# Altium schematic sheet S1 - POWER.SchDoc: 3.3V LDO  AND ESD/EMI PROTECTION
size A; PROJECT_NAME: BLUETOOTH STATUS BOARD; SHEET_TITLE: POWER MANAGEMENT SUBSYSTEMS; SIZE: A; DOCUMENT_ID: MIL-2021-ELEC-BTSTAT; CHECKED_BY: A. KUZMICKI; Parameter 1: 0; FIELD_1: BT BOARD POWER SUBSYSTEM; FIELD_2: A; FIELD_3: BLUETOOTH STATUS BOARD; FIELD_4: 0; FIELD_5: MACHINE INTELLIGENCE LAB; FIELD_6: M. TALEBI; FIELD_7: MIL-ELECTRICAL; FIELD_8: A. KUZMICKI; Engineer: M. TALEBI; Organization: MACHINE INTELLIGENCE LAB; Revision: 0; Project: BLUETOOTH SYSTEM STATUS BOARD
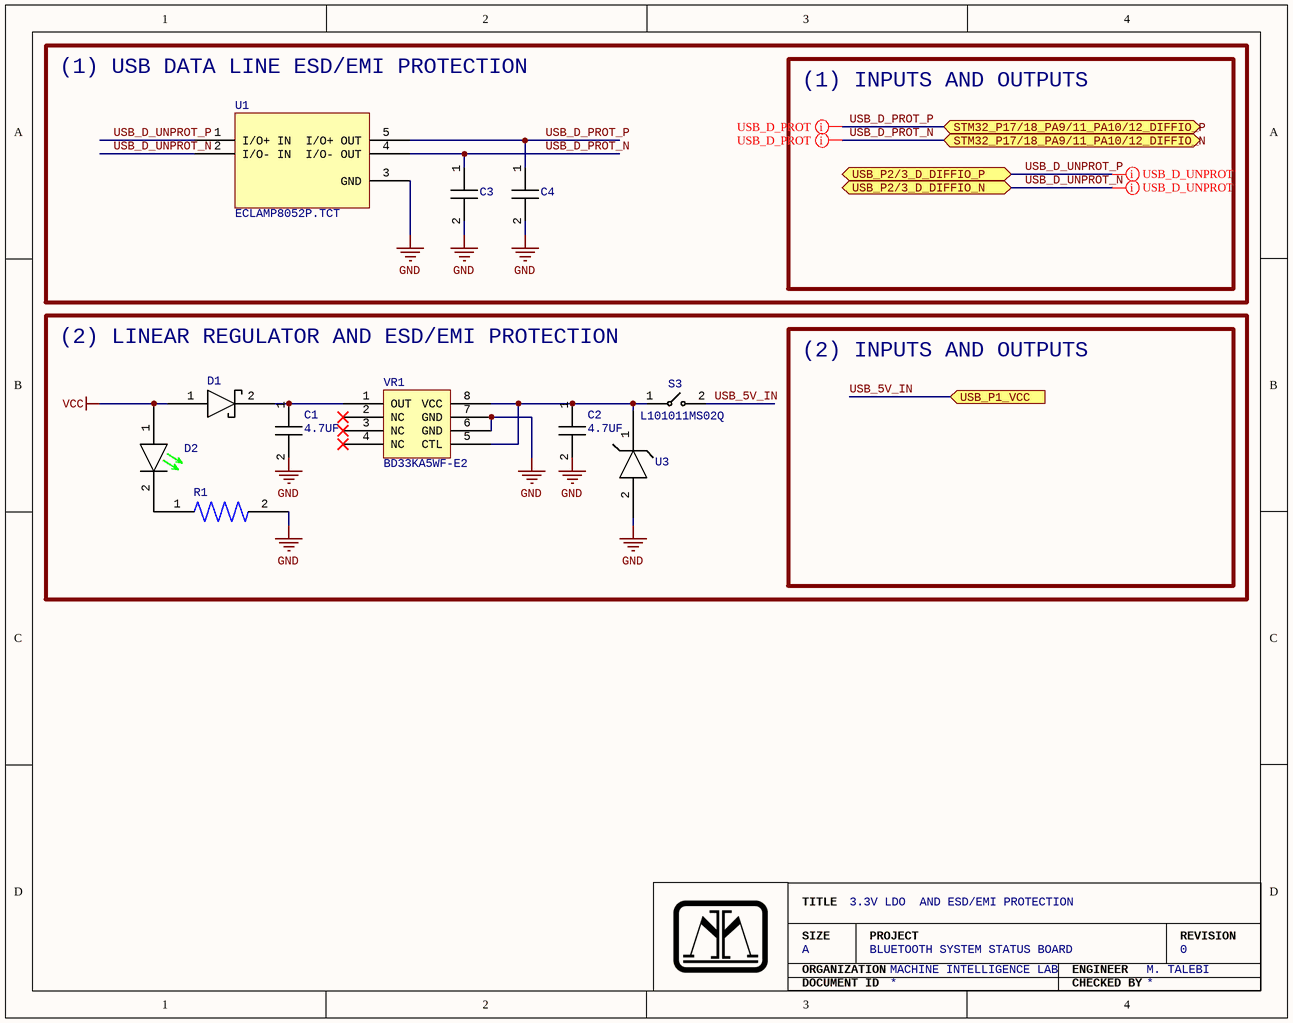
[diagram p0: S1 - POWER.SchDoc]

## Parts
C1  4.7UF  [TMK212AB7475KG-T]
C2  4.7UF  [TMK212AB7475KG-T]
C3  CC0603JRNPO8BN470  [CC0603JRNPO8BN470]  (value not drawn)
C4  CC0603JRNPO8BN470  [CC0603JRNPO8BN470]  (value not drawn)
D1  NRVB120VLSFT1G  [SODFL360X98-2N]  (value not drawn)
D2  151031VS06000  [151031VS06000]  (value not drawn)
R1  Y162440R0000B9R  [Y162440R0000B9R]  (value not drawn)
S3  L101011MS02Q  [L101011MS02Q]
U1  ECLAMP8052P.TCT  [ECLAMP8052P.TCT]
U3  UCLAMP0571P.TNT  [UCLAMP0571P.TNT]  (value not drawn)
VR1  BD33KA5WF-E2  [BD33KA5WF-E2]

## Ports
STM32_P17/18_PA9/11_PA10/12_DIFFIO_N (bidir), STM32_P17/18_PA9/11_PA10/12_DIFFIO_P (bidir), USB_P1_VCC (in), USB_P2/3_D_DIFFIO_N (bidir), USB_P2/3_D_DIFFIO_P (bidir)

## Nets
GND: C1.2 C2.2 C3.2 C4.2 R1.2 U1.3(GND) U3.2 VR1.6(GND) VR1.7(GND)
VCC: D1.1(-) D2.1(-)
USB_5V_IN: S3.2 ; port USB_P1_VCC
USB_D_PROT_N: C3.1 U1.4(I/O-_OUT) ; port STM32_P17/18_PA9/11_PA10/12_DIFFIO_N
USB_D_PROT_P: C4.1 U1.5(I/O+_OUT) ; port STM32_P17/18_PA9/11_PA10/12_DIFFIO_P
USB_D_UNPROT_N: U1.2(I/O-_IN) ; port USB_P2/3_D_DIFFIO_N
USB_D_UNPROT_P: U1.1(I/O+_IN) ; port USB_P2/3_D_DIFFIO_P
NetC1_1: C1.1 D1.2(+) VR1.1(OUT)
NetC2_1: C2.1 S3.1 U3.1 VR1.5(CTL) VR1.8(VCC)
NetD2_2: D2.2(+) R1.1

Not connected (* = marked no-connect by the designer): VR1 2(NC)* 3(NC)* 4(NC)*

## Layout directives
differential pair: USB_D_PROT_N, USB_D_PROT_P, USB_D_UNPROT_N, USB_D_UNPROT_P

## Notes on the sheet
- (1) USB DATA LINE ESD/EMI PROTECTION
- (1) INPUTS AND OUTPUTS
- (2) LINEAR REGULATOR AND ESD/EMI PROTECTION
- (2) INPUTS AND OUTPUTS
- TITLE
- SIZE
- ORGANIZATION
- A
- PROJECT
- ENGINEER
- REVISION
- DOCUMENT ID
- CHECKED BY

## Library data of the parts
C1 C2 = TMK212AB7475KG-T: CAP CER 4.7UF 25V X7R 0805; Tolerance: ±10%; Capacitance: 4.7 µF; Voltage - Rated: 25V; Temperature Coefficient: X7R; Operating Temperature: -55°C ~ 125°C; Applications: SMPS Filtering; Mounting Type: Surface Mount, MLCC; Package / Case: 0805 (2012 Metric); Size / Dimension: 0.079" L x 0.049" W (2.00mm x 1.25mm); Thickness (Max): 0.053" (1.35mm); ComponentLink1Description: Datasheet; ComponentLink1URL: https://www.yuden.co.jp/productdata/catalog/mlcc06_e.pdf; Supplier 1: Digi-Key; Supplier Part Number 1: 587-2990-1-ND
C3 C4 = CC0603JRNPO8BN470: CAP CER 47PF 25V NPO 0603; Tolerance: ±5%; Temperature Coefficient: C0G, NP0; Voltage - Rated: 25V; Operating Temperature: -55°C ~ 125°C; Applications: General Purpose; Mounting Type: Surface Mount, MLCC; Package / Case: 0603 (1608 Metric); Size / Dimension: 0.063" L x 0.031" W (1.60mm x 0.80mm); Thickness (Max): 0.035" (0.90mm); Capacitance: 47 pF; ComponentLink1Description: Datasheet; ComponentLink1URL: https://www.yageo.com/upload/media/product/productsearch/datasheet/mlcc/UPY-GP_NP0_16V-to-50V_18.pdf; Supplier 1: Digi-Key; Supplier Part Number 1: 311-3955-1-ND
D1 = NRVB120VLSFT1G: DIODE SCHOTTKY 20V 1A SOD123; Speed: Fast Recovery =< 500ns, > 200mA (Io); Voltage - Forward (Vf) (Max) @ If: 300 mV @ 1 A; Current - Reverse Leakage @ Vr: 15 mA @ 20 V; Diode Type: Schottky; Current - Average Rectified (Io): 1A; Mounting Type: Surface Mount; Package / Case: SOD-123F; Supplier Device Package: SOD-123FL; Operating Temperature - Junction: -65°C ~ 125°C; Voltage - DC Reverse (Vr) (Max): 20 V; Supplier 1: Future Electronics; Supplier Part Number 1: 3116510
D2 = 151031VS06000: LED GREEN DIFFUSED 3MM ROUND T/H; Configuration: Standard; Millicandela Rating: 30mcd; Lens Style: Round with Domed Top; Lens Size: 3.00mm Dia; Voltage - Forward (Vf) (Typ): 2.2V; Current - Test: 20mA; Viewing Angle: 60°; Wavelength - Dominant: 568nm; Wavelength - Peak: 560nm; Color: Green; Lens Color: Green; Lens Transparency: Diffused; Mounting Type: Through Hole; Package / Case: Radial; Supplier Device Package: 3mm Round; Height (Max): 5.55mm; Supplier 1: Digi-Key; Supplier Part Number 1: 732-5008-ND
R1 = Y162440R0000B9R: RES SMD 40 OHM 0.1% 1/5W 0805; Power (Watts): 0.2W, 1/5W; Temperature Coefficient: ±0.2ppm/°C; Resistance: 40 Ohms; Tolerance: ±0.1%; Composition: Metal Foil; Features: Moisture Resistant, Non-Inductive; Operating Temperature: -55°C ~ 150°C; Package / Case: 0805 (2012 Metric); Supplier Device Package: 0805; Size / Dimension: 0.080" L x 0.050" W (2.03mm x 1.27mm); Height - Seated (Max): 0.025" (0.64mm); Number of Terminations: 2; ComponentLink1Description: Datasheet; ComponentLink1URL: http://www.vishaypg.com/docs/63060/VSMP.pdf
S3 = L101011MS02Q: SWITCH SLIDE SPST 4A 125V; Contact Timing: Not Specified; Switch Function: On-Off; Current Rating (Amps): 4A (AC/DC); Actuator Type: Standard; Actuator Length: 5.08mm; Actuator Material: Polyamide (PA66), Nylon 6/6; Switch Travel: 3.81mm; Electrical Life: 10,000 Cycles; Voltage Rating - DC: 28 V; Circuit: SPST; Contact Material: Copper; Contact Finish: Silver; Mounting Type: Through Hole; Termination Style: PC Pin; Operating Temperature: -30°C ~ 65°C; Voltage Rating - AC: 125 V; ComponentLink1Description: Datasheet; ComponentLink1URL: https://www.ckswitches.com/media/1423/l.pdf; Supplier 1: Digi-Key; Supplier Part Number 1: CKC5106-ND
U1 = ECLAMP8052P.TCT: CMC 2LN SMD ESD AEC-Q100; Number of Lines: 2; DC Resistance (DCR) (Max): 1.8Ohm; Operating Temperature: -40°C ~ 125°C; Ratings: AEC-Q100; Features: ESD; Mounting Type: Surface Mount; Size / Dimension: 0.075" L x 0.067" W (1.90mm x 1.70mm); Height (Max): 0.024" (0.60mm); Package / Case: 5-UFDFN; ComponentLink1Description: Datasheet; ComponentLink1URL: https://semtech.my.salesforce.com/sfc/p/#E0000000JelG/a/44000000MClt/x4_O.M8f1_5l6CovuR7Nj9RxqDFB_sAgVeqN73g7pps; Supplier 1: Digi-Key; Supplier Part Number 1: ECLAMP8052P.TCTCT-ND
U3 = UCLAMP0571P.TNT: TVS DIODE 5V 15V SGP1610N2; Voltage - Reverse Standoff (Typ): 5V (Max); Voltage - Breakdown (Min): 6V; Current - Peak Pulse (10/1000µs): 80A; Power Line Protection: No; Capacitance @ Frequency: 675pF @ 1MHz; Unidirectional Channels: 1; Type: Zener; Voltage - Clamping (Max) @ Ipp: 15V; Applications: Automotive; Operating Temperature: -40°C ~ 125°C (TJ); Mounting Type: Surface Mount; Package / Case: 2-UDFN; Supplier Device Package: SGP1610N2; Supplier 1: Digi-Key; Supplier Part Number 1: UCLAMP0571P.TNTCT-ND; ComponentLink1Description: Datasheet; ComponentLink1URL: https://semtech.my.salesforce.com/sfc/p/#E0000000JelG/a/440000001MYJ/IUMjL3gSEdL0j_8aQaHuKPXW_0n5uJ8aCJSLGDAHDuk
VR1 = BD33KA5WF-E2: IC REG LINEAR 3.3V 500MA 8SOP; Output Configuration: Positive; Output Type: Fixed; Voltage - Input (Max): 5.5V; Voltage Dropout (Max): 0.2V @ 200mA; PSRR: 50dB (120Hz); Control Features: Enable; Protection Features: Over Current, Over Temperature; Number of Regulators: 1; Current - Quiescent (Iq): 550 µA; Voltage - Output (Min/Fixed): 3.3V; Current - Output: 500mA; Operating Temperature: -40°C ~ 105°C; Mounting Type: Surface Mount; Package / Case: 8-SOIC (0.173", 4.40mm Width); Supplier Device Package: 8-SOP; Current - Supply (Max): 550 µA; Supplier 1: Digi-Key; Supplier Part Number 1: BD33KA5WF-E2CT-ND